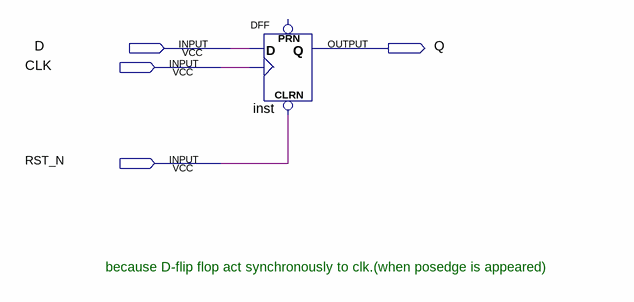
[diagram p0: schematic sheet]
// Quartus schematic week4_1_dff.bdf as structural Verilog: 1 symbols, 4 pins
module week4_1_dff (
  input  D,
  input  CLK,
  input  RST_N,
  output Q
);

  DFF inst (.CLRN(RST_N), .CLK(CLK), .D(D), .Q(Q));  // open: PRN

  // Notes on the sheet:
  //   because D-flip flop act synchronously to clk.(when posedge is appeared)
endmodule
